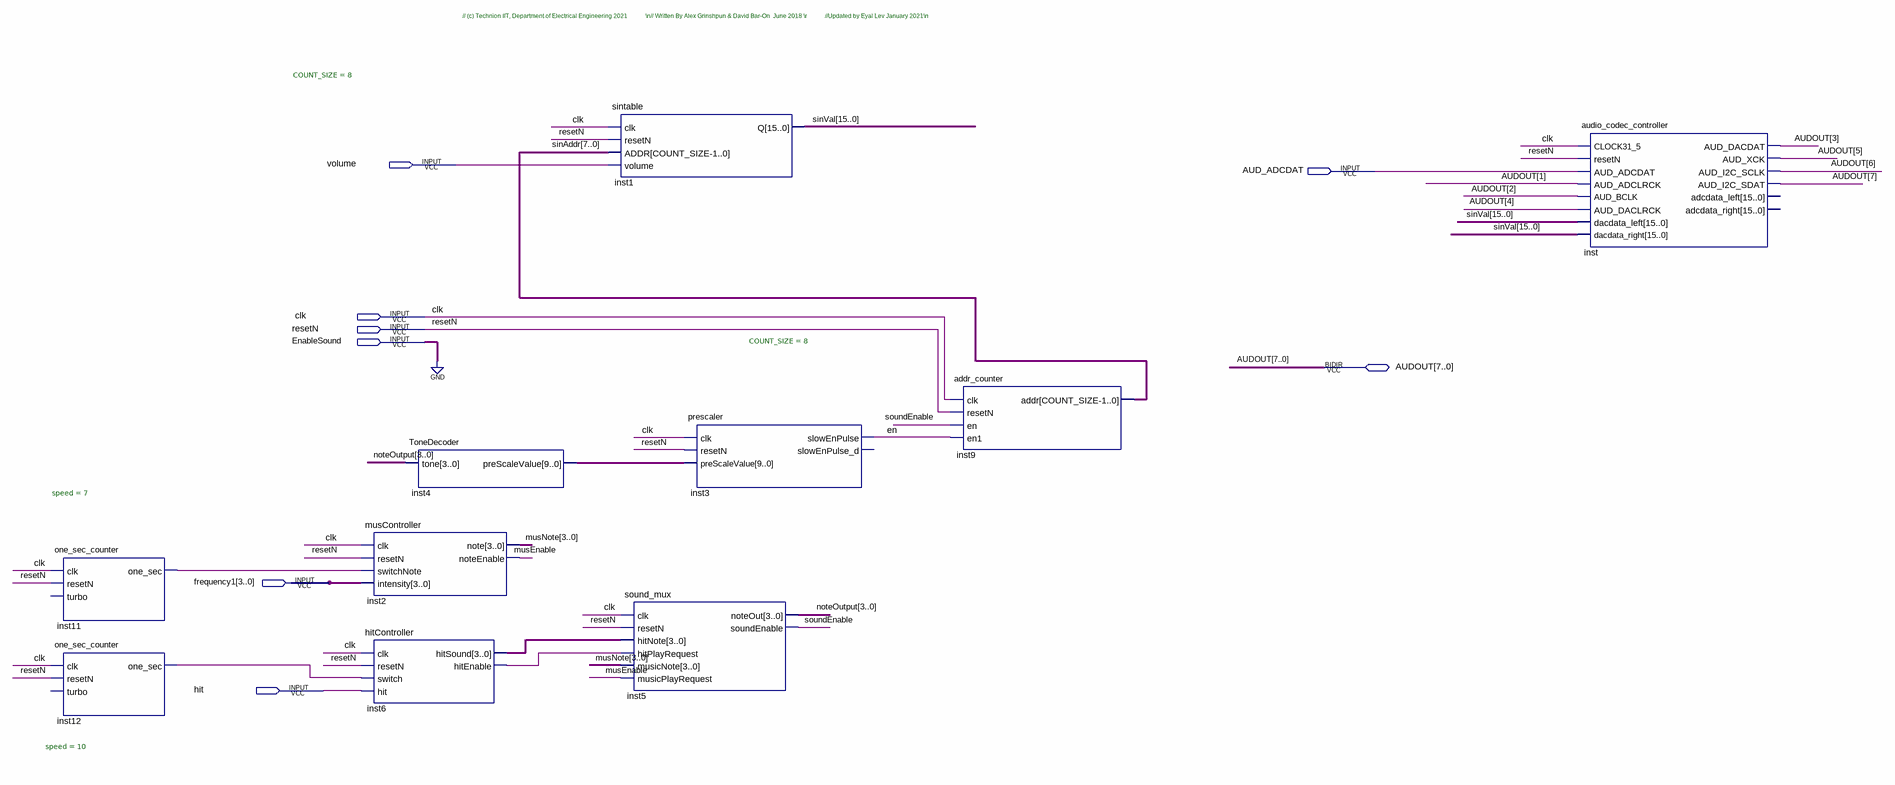
[diagram p0: schematic sheet]
// Quartus schematic AUDIO.bdf as structural Verilog: 10 symbols, 8 pins
module AUDIO (
  input  volume,
  input  AUD_ADCDAT,
  input  clk,
  input  resetN,
  input  EnableSound,
  input  [3:0] frequency1,
  input  hit,
  inout  [7:0] AUDOUT
);

  wire en, inst6_hitenable, inst11_one_sec, inst12_one_sec, musEnable, soundEnable;
  wire [3:0] inst6_hitsound, musNote, noteOutput;
  wire [7:0] sinAddr;
  wire [9:0] inst4_prescalevalue;
  wire [15:0] sinVal;

  one_sec_counter #(.speed(7)) inst11 (.clk(clk), .resetN(resetN), .one_sec(inst11_one_sec));  // open: turbo
  one_sec_counter #(.speed(10)) inst12 (.clk(clk), .resetN(resetN), .one_sec(inst12_one_sec));  // open: turbo
  musController inst2 (
    .clk(clk), .resetN(resetN), .switchNote(inst11_one_sec), .intensity(frequency1), .note(musNote),
    .noteEnable(musEnable));
  hitController inst6 (
    .clk(clk), .resetN(resetN), .switch(inst12_one_sec), .hit(hit), .hitSound(inst6_hitsound),
    .hitEnable(inst6_hitenable));
  ToneDecoder inst4 (.tone(noteOutput), .preScaleValue(inst4_prescalevalue));
  sintable #(.COUNT_SIZE(8)) inst1 (.clk(clk), .resetN(resetN), .ADDR(sinAddr), .volume(volume), .Q(sinVal));
  sound_mux inst5 (
    .clk(clk), .resetN(resetN), .hitNote(inst6_hitsound), .hitPlayRequest(inst6_hitenable),
    .musicNote(musNote), .musicPlayRequest(musEnable), .noteOut(noteOutput), .soundEnable(soundEnable));
  prescaler inst3 (
    .clk(clk), .resetN(resetN), .preScaleValue(inst4_prescalevalue), .slowEnPulse(en));  // open: slowEnPulse_d
  addr_counter #(.COUNT_SIZE(8)) inst9 (.clk(clk), .resetN(resetN), .en(soundEnable), .en1(en), .addr(sinAddr));
  audio_codec_controller inst (
    .CLOCK31_5(clk), .resetN(resetN), .AUD_ADCDAT(AUD_ADCDAT), .AUD_ADCLRCK(AUDOUT[1]), .AUD_BCLK(AUDOUT[2]),
    .AUD_DACLRCK(AUDOUT[4]), .dacdata_left(sinVal), .dacdata_right(sinVal), .AUD_DACDAT(AUDOUT[3]),
    .AUD_XCK(AUDOUT[5]), .AUD_I2C_SCLK(AUDOUT[6]), .AUD_I2C_SDAT(AUDOUT[7]));  // open: adcdata_left, adcdata_right
  // also tied to GND on the sheet: EnableSound

  // Notes on the sheet:
  //   // (c) Technion IIT, Department of Electrical Engineering 2021            \n// Written By Alex Grinshpun & David Bar-On  June 2018 \r            //Updated by Eyal Lev January 2021\n
endmodule
